# EAGLE design usbasp (EAGLE 7.2.0)
CNAME: USB ASP (Dru Mod); CREVISION: 0.1; DESIGNER: Thomas Fischl
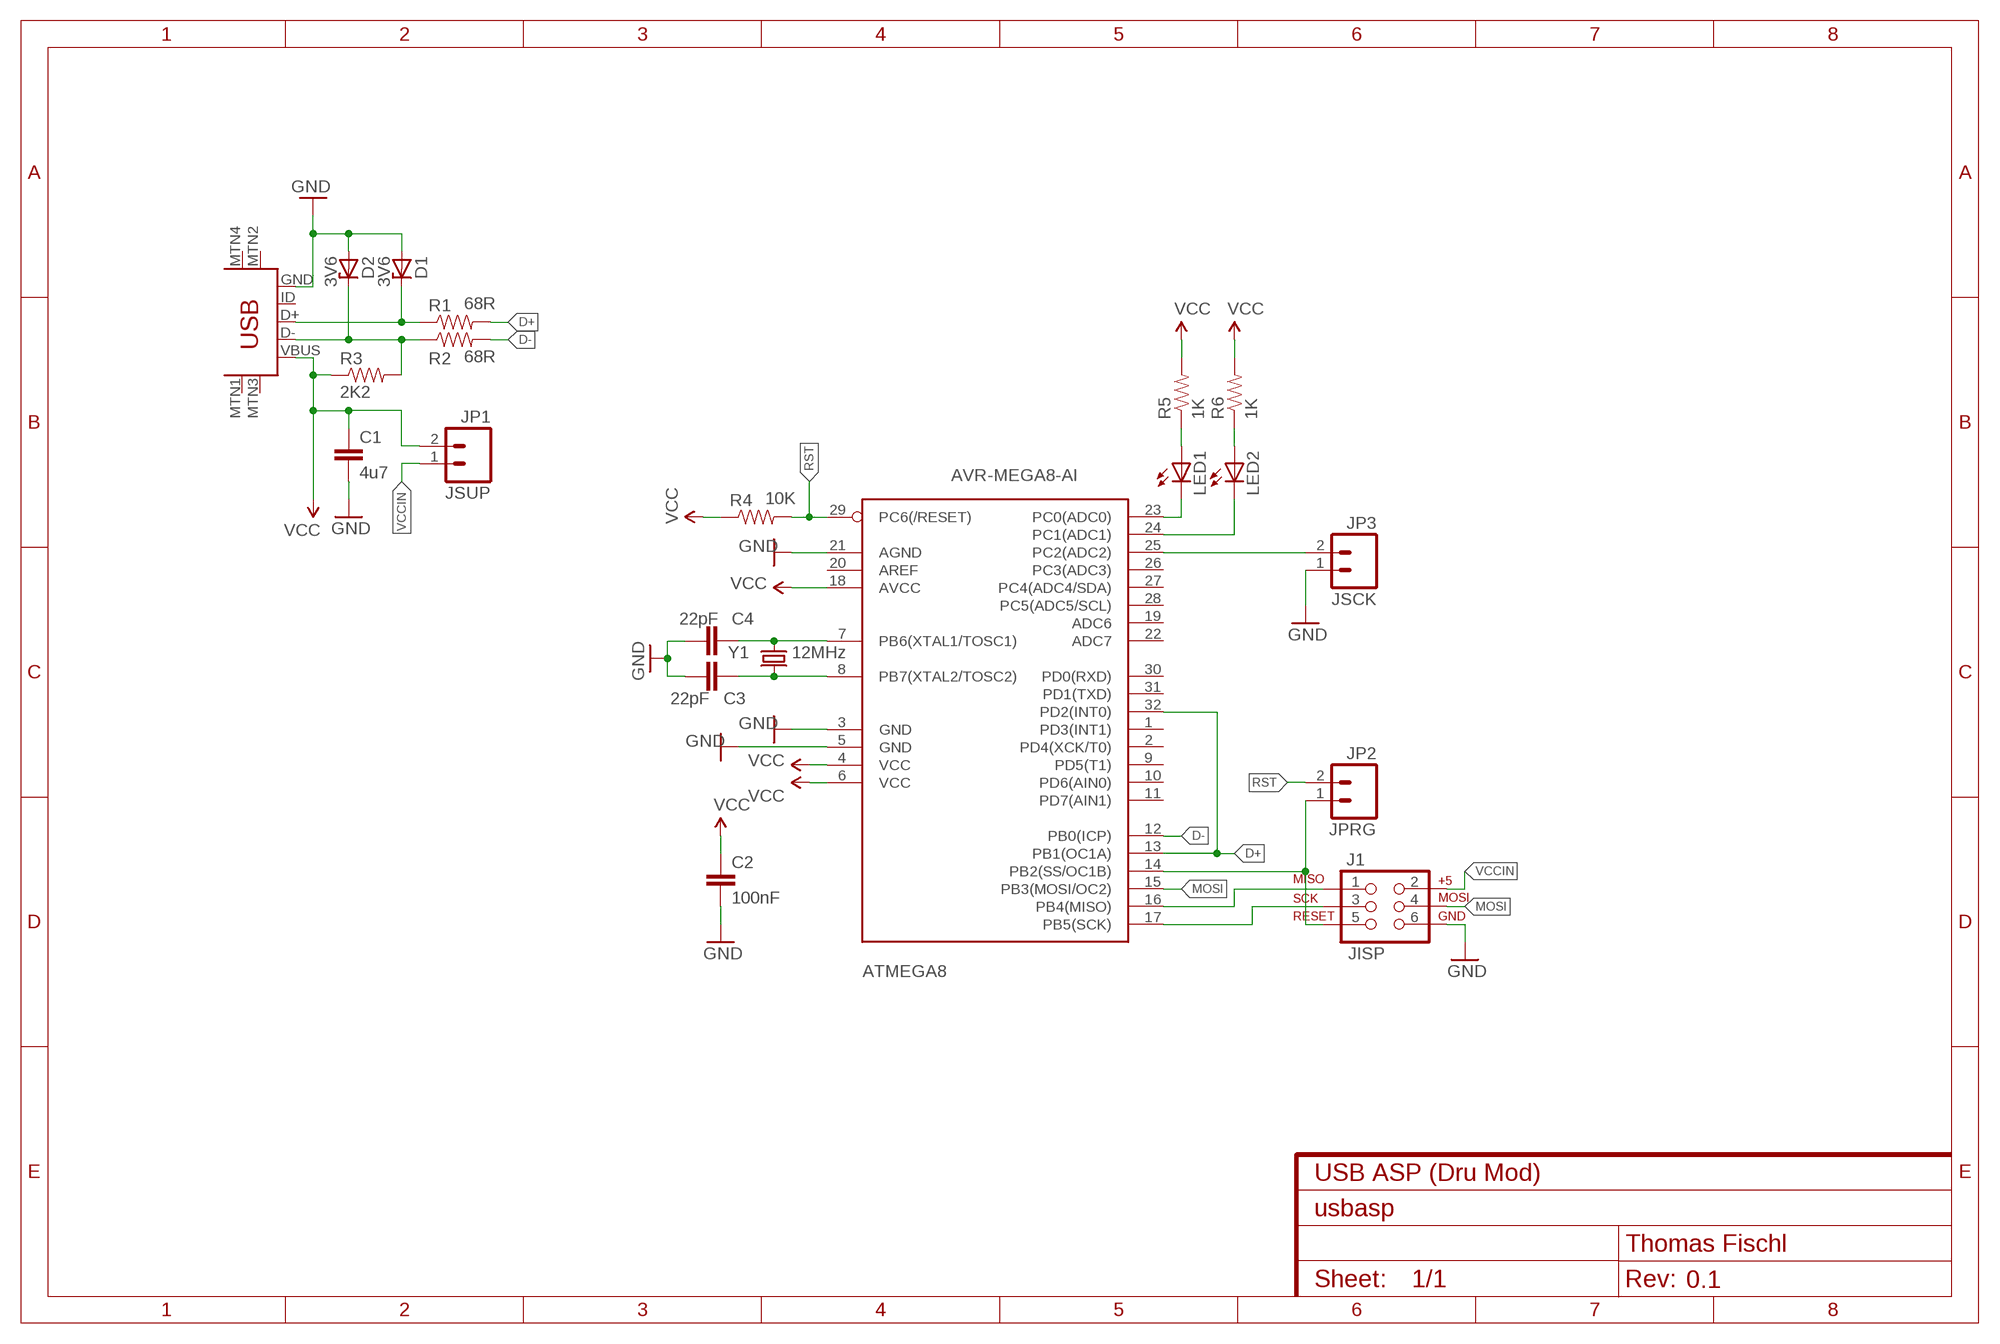
[diagram p0: schematic, sheet 1]

## Parts
ATMEGA8  AVR-MEGA8-AI  [TQFP32-08]
C1  4u7  CAP0603-CAP  [0603-CAP]
C2  100nF  CAP0805  [0805]
C3  22pF  CAP0805  [0805]
C4  22pF  CAP0805  [0805]
D1  3V6  ZENER-DIODESOD80C  [SOD80C]
D2  3V6  ZENER-DIODESOD80C  [SOD80C]
J1  JISP  AVR_SPI_PRG_6PTH  [2X3]
JP1  JSUP  M02PTH  [1X02]
JP2  JPRG  M02PTH  [1X02]
JP3  JSCK  M02PTH  [1X02]
LED1  LEDCHIPLED_0805  [CHIPLED_0805]
LED2  LEDCHIPLED_0805  [CHIPLED_0805]
R1  68R  RESISTOR0603-RES  [0603-RES]
R2  68R  RESISTOR0603-RES  [0603-RES]
R3  2K2  RESISTOR0603-RES  [0603-RES]
R4  10K  RESISTOR0603-RES  [0603-RES]
R5  1K  RESISTOR0603-RES  [0603-RES]
R6  1K  RESISTOR0603-RES  [0603-RES]
U$2  USB-MINIB-5PIN  [USB-MINIB]
Y1  12MHz  CRYSTALSMD  [HC49UP]

## Nets
D+: ATMEGA8.13(PB1(OC1A)) ATMEGA8.32(PD2(INT0)) R1.2
D-: ATMEGA8.12(PB0(ICP)) R2.2
GND: ATMEGA8.3(GND) ATMEGA8.5(GND) ATMEGA8.21(AGND) C1.2 C2.2 C3.2 C4.1 D1.A D2.A J1.6 JP3.1 U$2.GND
MOSI: ATMEGA8.15(PB3(MOSI/OC2)) J1.4
N$1: D2.C R2.1 R3.2 U$2.D-
N$2: D1.C R1.1 U$2.D+
N$3: ATMEGA8.7(PB6(XTAL1/TOSC1)) C4.2 Y1.1
N$4: ATMEGA8.8(PB7(XTAL2/TOSC2)) C3.1 Y1.2
N$5: ATMEGA8.14(PB2(SS/OC1B)) J1.5 JP2.1
N$6: ATMEGA8.23(PC0(ADC0)) LED1.C
N$7: ATMEGA8.24(PC1(ADC1)) LED2.C
N$8: LED1.A R5.1
N$9: LED2.A R6.1
N$10: ATMEGA8.25(PC2(ADC2)) JP3.2
N$11: ATMEGA8.16(PB4(MISO)) J1.1
N$12: ATMEGA8.17(PB5(SCK)) J1.3
RST: ATMEGA8.29(PC6(/RESET)) JP2.2 R4.2
VCC: ATMEGA8.4(VCC) ATMEGA8.6(VCC) ATMEGA8.18(AVCC) C1.1 C2.1 JP1.2 R3.1 R4.1 R5.2 R6.2 U$2.VBUS
VCCIN: J1.2 JP1.1
Unconnected: ATMEGA8.1(PD3(INT1)) ATMEGA8.2(PD4(XCK/T0)) ATMEGA8.9(PD5(T1)) ATMEGA8.10(PD6(AIN0)) ATMEGA8.11(PD7(AIN1)) ATMEGA8.19(ADC6) ATMEGA8.20(AREF) ATMEGA8.22(ADC7) ATMEGA8.26(PC3(ADC3)) ATMEGA8.27(PC4(ADC4/SDA)) ATMEGA8.28(PC5(ADC5/SCL)) ATMEGA8.30(PD0(RXD)) ATMEGA8.31(PD1(TXD)) U$2.ID U$2.MTN1(MTN2) U$2.MTN2(MTN3) U$2.MTN3(MTN1) U$2.MTN4

## Library data of the parts
ATMEGA8 = SparkFun-DigitalIC:AVR-MEGA8: MICROCONTROLLER 8 Kbytes FLASH 1 kbytes SRAM 512 bytes EEPROM USART 6-channel 10 bit ADC 2-channel 8 bit ADC
C1-C4 = SparkFun-Passives:CAP: Capacitor Standard 0603 ceramic capacitor, and 0.1" leaded capacitor.
D1 D2 = diode:ZENER-DIODE: Z-Diode
J1 = SparkFun-Connectors:AVR_SPI_PRG_6: AVR ISP 6 Pin This is the reduced ISP connector for AVR programming. Common on Arduino. This footprint will take up less PCB space and can be used with a 10-pin to 6-pin adapter such as SKU: BOB-08508 **Special note about "TEST_POINT" package. The stop mask is on the top side, so if you want your programming test points to be on the bottom of your board, make sure to place this package on the bottom side of the board. This also ensure that the orientation to program from the bottom side will be correct.
JP1-JP3 = SparkFun-Connectors:M02: Standard 2-pin 0.1" header. Use with - straight break away headers ( PRT-00116) - right angle break away headers (PRT-00553) - swiss pins (PRT-00743) - machine pins (PRT-00117) - female headers (PRT-00115) Molex polarized connector foot print use with: PRT-08233 with associated crimp pins and housings. 2.54_SCREWTERM for use with PRT-10571. 3.5mm Screw Terminal footprints for PRT-08084 5mm Screw Terminal footprints for use with PRT-08432
LED1 LED2 = adafruit:LED: LED OSRAM: - CHIPLED LG R971, LG N971, LY N971, LG Q971, LY Q971, LO R971, LY R971 LH N974, LH R974 LS Q976, LO Q976, LY Q976 LO Q996 - Hyper CHIPLED LW Q18S LB Q993, LB Q99A, LB R99A - SideLED LS A670, LO A670, LY A670, LG A670, LP A670 LB A673, LV A673, LT A673, LW A673 LH A674 LY A675 LS A676, LA A676, LO A676, LY A676, LW A676 LS A679, LY A679, LG A679 - Hyper Micro SIDELED® LS Y876, LA Y876, LO Y876, LY Y876 LT Y87S - SmartLED LW L88C, LW L88S LB L89C, LB L89S, LG L890 LS L89K, LO L89K, LY L89K LS L896, LA L896, LO L896, LY L896 - TOPLED LS T670, LO T670, LY T670, LG T670, LP T670 LSG T670, LSP T670, LSY T670, LOP T670, LYG T670 LG T671, LOG T671, LSG T671 LB T673, LV T673, LT T673, LW T673 LH T674 LS T676, LA T676, LO T676, LY T676, LB T676, LH T676, LSB T676, LW T676 LB T67C, LV T67C, LT T67C, LS T67K, LO T67K, LY T67K, LW E67C LS E67B, LA E67B, LO E67B, LY E67B, LB E67C, LV E67C, LT E67C LW T67C LS T679, LY T679, LG T679 LS T770, LO T770, LY T770, LG T770, LP T770 LB T773, LV T773, LT T773, LW T773 LH T774 LS E675, LA E675, LY E675, LS T675 LS T776, LA T776, LO T776, LY T776, LB T776 LHGB T686 LT T68C, LB T68C - Hyper Mini TOPLED® LB M676 - Mini TOPLED Santana® LG M470 LS M47K, LO M47K, LY M47K Source: http://www.osram.convergy.de/
R1-R6 = SparkFun-Passives:RESISTOR: Resistor Basic schematic elements and footprints for 0603, 1206, and PTH resistors.
U$2 = SparkFun-Connectors:USB-MINIB: Mini-USB "B" connector with 5th pin broken out. Created new symbol breaking out 5th "ID" pin in mini/micro USB connector spec. See: http://en.wikipedia.org/wiki/Mini_usb#Cables. Uses same footprint as 4-pin symbol. Also added pins to connect to mounting / shield pads if required (probably not generally needed as signals aren't shielded once they leave the connector).
Y1 = SparkFun-FreqCtrl:CRYSTAL: Various standard crystals. Proven footprints. Spark Fun Electronics SKU : COM-00534

## Board
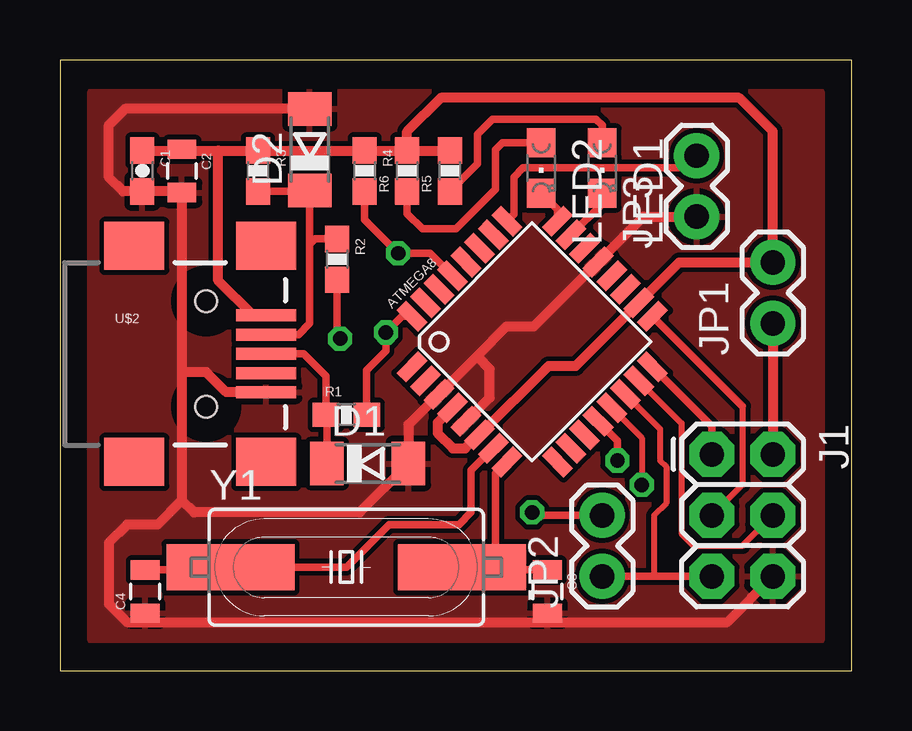
[diagram p1: board, top side]
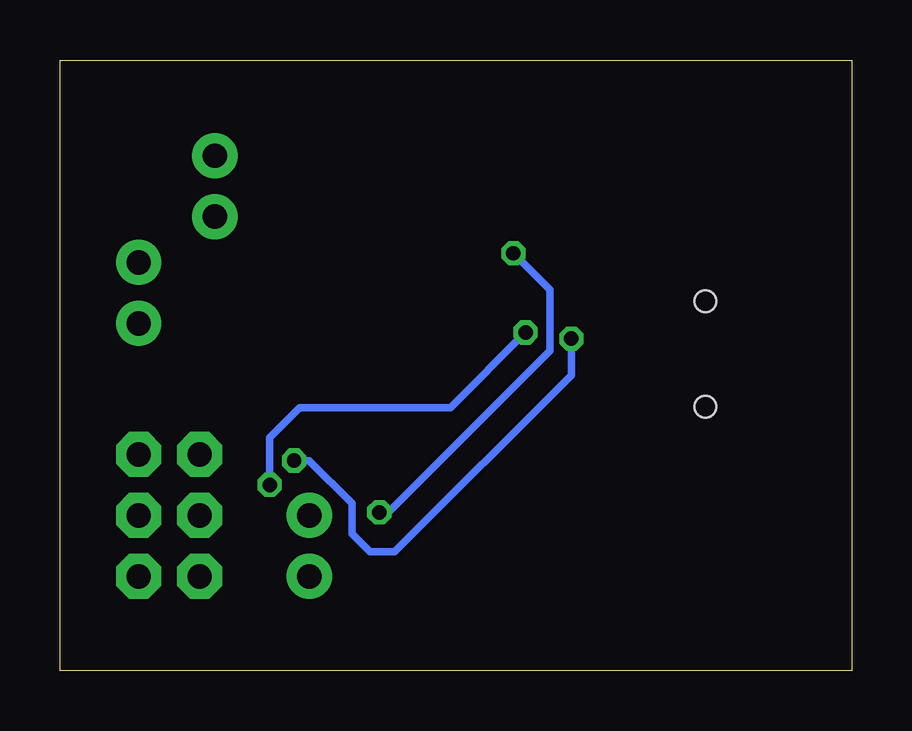
[diagram p2: board, bottom side, seen from below]

Size 33 x 25.45 mm. Coordinates in mm from the lower left corner, seen from the top.
Outline: 0,0 33,0 33,25.45 0,25.45 0,0
Copper layers (1*16): Top 0.035mm / dielectric 1.5mm / Bottom 0.035mm
Design rules "default *": minimum track width 10mil, minimum drill 24mil, track to track 8mil, track to pad 8mil, pad to pad 8mil, via to via 8mil, smd to smd 8mil, copper to edge 40mil, drill to drill 8mil, minimum pad ring 10mil, minimum via ring 8mil, stop-mask expansion 4mil, vias tented up to drill 0mil, thermal gap 10mil

### Footprints (pad centres in the part's own frame; a part is rotated, then mirrored left to right if it is on the bottom)
TQFP32-08 = smd 1.27 x 0.559: 1 -4.293,2.8; 2 -4.293,2; 3 -4.293,1.2; 4 -4.293,0.4; 5 -4.293,-0.4; 6 -4.293,-1.2; 7 -4.293,-2; 8 -4.293,-2.8; 17 4.293,-2.8; 18 4.293,-2; 19 4.293,-1.2; 20 4.293,-0.4; 21 4.293,0.4; 22 4.293,1.2; 23 4.293,2; 24 4.293,2.8 | smd 0.559 x 1.27: 9 -2.8,-4.293; 10 -2,-4.293; 11 -1.2,-4.293; 12 -0.4,-4.293; 13 0.4,-4.293; 14 1.2,-4.293; 15 2,-4.293; 16 2.8,-4.293; 25 2.8,4.293; 26 2,4.293; 27 1.2,4.293; 28 0.4,4.293; 29 -0.4,4.293; 30 -1.2,4.293; 31 -2,4.293; 32 -2.8,4.293
0603-CAP = smd 1.1 x 1: 1 -0.85,0; 2 0.85,0
0805 = smd 0.8 x 1.2: 1 -0.9,0; 2 0.9,0
SOD80C = smd 1.4 x 1.8: A 1.7,0; C -1.7,0
2X3 = drill 1.016 pad 1.88 octagon: 1 0,0; 2 0,2.54; 3 2.54,0; 4 2.54,2.54; 5 5.08,0; 6 5.08,2.54
1X02 = drill 1.016 pad 1.88: 1 0,0; 2 2.54,0
CHIPLED_0805 = smd 1.2 x 1.2: A 0,-1.05; C 0,1.05
0603-RES = smd 1.1 x 1: 1 -0.85,0; 2 0.85,0
USB-MINIB = smd 2.5 x 0.5: D+ 2.5,0; D- 2.5,0.8; GND 2.5,-1.6; ID 2.5,-0.8; VBUS 2.5,1.6 | smd 2.5 x 2: MTN1 -3,4.5; MTN2 2.5,4.5; MTN3 -3,-4.5; MTN4 2.5,-4.5 | hole 0.9: 0,2.2; 0,-2.2
HC49UP = smd 5.334 x 1.93: 1 -4.826,0; 2 4.826,0

### Placement (x,y rotation side)
ATMEGA8  19.68,13.72 45 top
C1  3.43,20.83 270 top
C2  5.08,20.83 270 top
C3  20.32,3.3 270 top
C4  3.56,3.3 90 top
D1  12.83,8.64 0 top
D2  10.41,21.72 90 top
J1  27.18,9.02 270 top
JP1  29.72,14.48 90 top
JP2  22.61,3.94 90 top
JP3  26.54,18.92 90 top
LED1  22.61,20.95 180 top
LED2  20.07,20.95 180 top
R1  11.94,10.67 0 top
R2  11.56,17.14 270 top
R3  8.26,20.83 270 top
R4  12.7,20.83 270 top
R5  16.26,20.83 90 top
R6  14.48,20.83 90 top
U$2  6.1,13.21 0 top
Y1  11.94,4.32 0 top

### Tracks (layer width: path | path; a pad name or v marks a point on that pad's centre or on a via)
D+  (via drill 0.6)
  Top 0.254: ATMEGA8.13 24.26,9.71 v24.26,7.75
  Top 0.305: ATMEGA8.32 14.26,14.77 v13.59,14.1 13.59,13.34 12.79,12.53 R1.2
  Bottom 0.305: v13.59,14.1 16.72,10.96 ATMEGA8.13 24.26,9.71 v24.26,7.75
D-  (via drill 0.6)
  Top 0.305: R2.2 11.56,13.97 v11.68,13.84 | v23.24,8.76 23.24,9.59 ATMEGA8.12
  Bottom 0.305: v11.68,13.84 11.68,12.32 19.05,4.95 20.07,4.95 20.83,5.71 20.83,6.99 22.61,8.76 v23.24,8.76
GND
  Top 0.305: C4.1 3.56,2.29 3.81,2.03
  Top 0.406: 5.08,12.45 C2.2 5.03,19.98 C1.2 2.63,19.98 2.03,20.57 2.03,22.73 2.72,23.42 D2.A | 5.08,12.45 5.08,7.11 | 5.08,7.11 4.06,6.1 2.79,6.1 2.03,5.33 2.03,2.79 2.79,2.03 3.81,2.03 20.45,2.03 | 20.45,2.03 27.81,2.03 J1.6 | U$2.GND 6.93,11.61 6.1,12.45 5.08,12.45 | 5.08,7.11 5.59,6.6 12.49,6.6 D1.A 14.53,10.26 ATMEGA8.3 17.44,13.17 | C3.2 20.45,2.27 20.45,2.03 | 17.44,13.17 18.62,14.35 19.75,14.35 ATMEGA8.21 24.33,18.92 JP3.1 | ATMEGA8.5 17.91,11.37 17.91,12.57 17.44,13.04 17.44,13.17
  pour Top: 1.27,24.13 31.75,24.13 31.75,1.27 1.27,1.27
MOSI
  Top 0.254: ATMEGA8.15 25.91,10.32 25.91,5.71 26.42,5.21 28.45,5.21 J1.4
N$1
  Top 0.305: U$2.D- 9.94,14.01 10.41,14.48 10.41,17.78 | 10.41,17.78 D2.C 10.38,19.98 R3.2 | R2.1 10.63,18 10.41,17.78
N$2
  Top 0.305: U$2.D+ 10.16,13.21 11.09,12.28 R1.1 11.13,10.63 D1.C
N$3
  Top 0.305: C4.2 7,4.2 Y1.1 11.94,4.32 13.72,6.1 16.64,6.1 17.14,6.6 17.14,8.35 ATMEGA8.7
N$4
  Top 0.305: ATMEGA8.8 18.16,8.23 18.16,4.19 | 18.16,4.19 18.17,4.2 C3.1 | Y1.2 17.27,3.81 17.78,3.81 18.16,4.19
N$5
  Top 0.254: ATMEGA8.14 25.02,10.08 25.02,8.76 25.27,8.51 25.27,6.99 24.77,6.48 24.77,3.94
  Top 0.305: JP2.1 24.77,3.94 J1.5
N$6
  Top 0.305: ATMEGA8.23 22.61,19.46 LED1.C
N$7
  Top 0.305: ATMEGA8.24 20.74,19.23 LED2.C
N$8
  Top 0.305: R5.1 17.4,21.12 17.4,22.35 18.03,22.99 22.35,22.99 22.61,22.73 LED1.A
N$9
  Top 0.305: R6.1 14.48,19.05 15.11,18.41 16.51,18.41 18.16,20.07 18.16,21.72 18.45,22 LED2.A
N$10
  Top 0.305: ATMEGA8.25 18.92,19.02 18.92,20.57 19.3,20.95 25.78,20.95 26.29,21.46 JP3.2
N$11
  Top 0.305: ATMEGA8.16 27.18,10.18 J1.1
N$12
  Top 0.254: 28.45,11.02 28.45,7.75 J1.3
  Top 0.305: ATMEGA8.17 28.45,11.02
RST  (via drill 0.6)
  Top 0.305: ATMEGA8.29 15.44,17.4 v14.1,17.4 12.7,18.8 R4.2 | v19.68,6.6 19.81,6.48 JP2.2
  Bottom 0.305: v14.1,17.4 12.57,15.88 12.57,13.34 19.3,6.6 v19.68,6.6
VCC
  Top 0.406: U$2.VBUS 8.05,14.81 6.6,16.26 6.6,21.68 | C1.1 5.03,21.68 C2.1 5.13,21.68 6.6,21.68 | 6.6,21.68 R3.1 R4.1 R6.2 | R6.2 R5.2 | R6.2 14.48,22.48 15.88,23.88 28.32,23.88 29.72,22.48 JP1.2 25.82,17.02 ATMEGA8.18 21.5,12.7 20.37,12.7 ATMEGA8.6 17.45,9.83 16.89,9.27 16.38,9.27 15.75,9.91 15.75,10.35 ATMEGA8.4
VCCIN
  Top 0.406: JP1.1 J1.2